# Altium schematic sheet rNET_POE_Sensor._Sheet2_RevA1.SchDoc
size D; Organization: Altium Limited; Address1: L3, 12a Rodborough Rd; Address2: Frenchs Forest; Address3: NSW; Address4: Australia 2086; SheetNumber: 2; PageSetup: Record=PageOptions|CenterHorizontal=True|CenterVertical=True|PrintScale=0.52|XCorrection=1.00|YCorrection=1.00|PrintKind=0|BorderSize=5000000|LeftOffset=0|BottomOffset=0|Orientation=2|PaperLength=4318|PaperWidth=2794|Scale=100|PaperSource=7|PrintQuality=-4|MediaType=1|DitherType=10|PrintScaleMode=1|PaperKind=Ledger (11 x 17 in)|PaperIndex=3
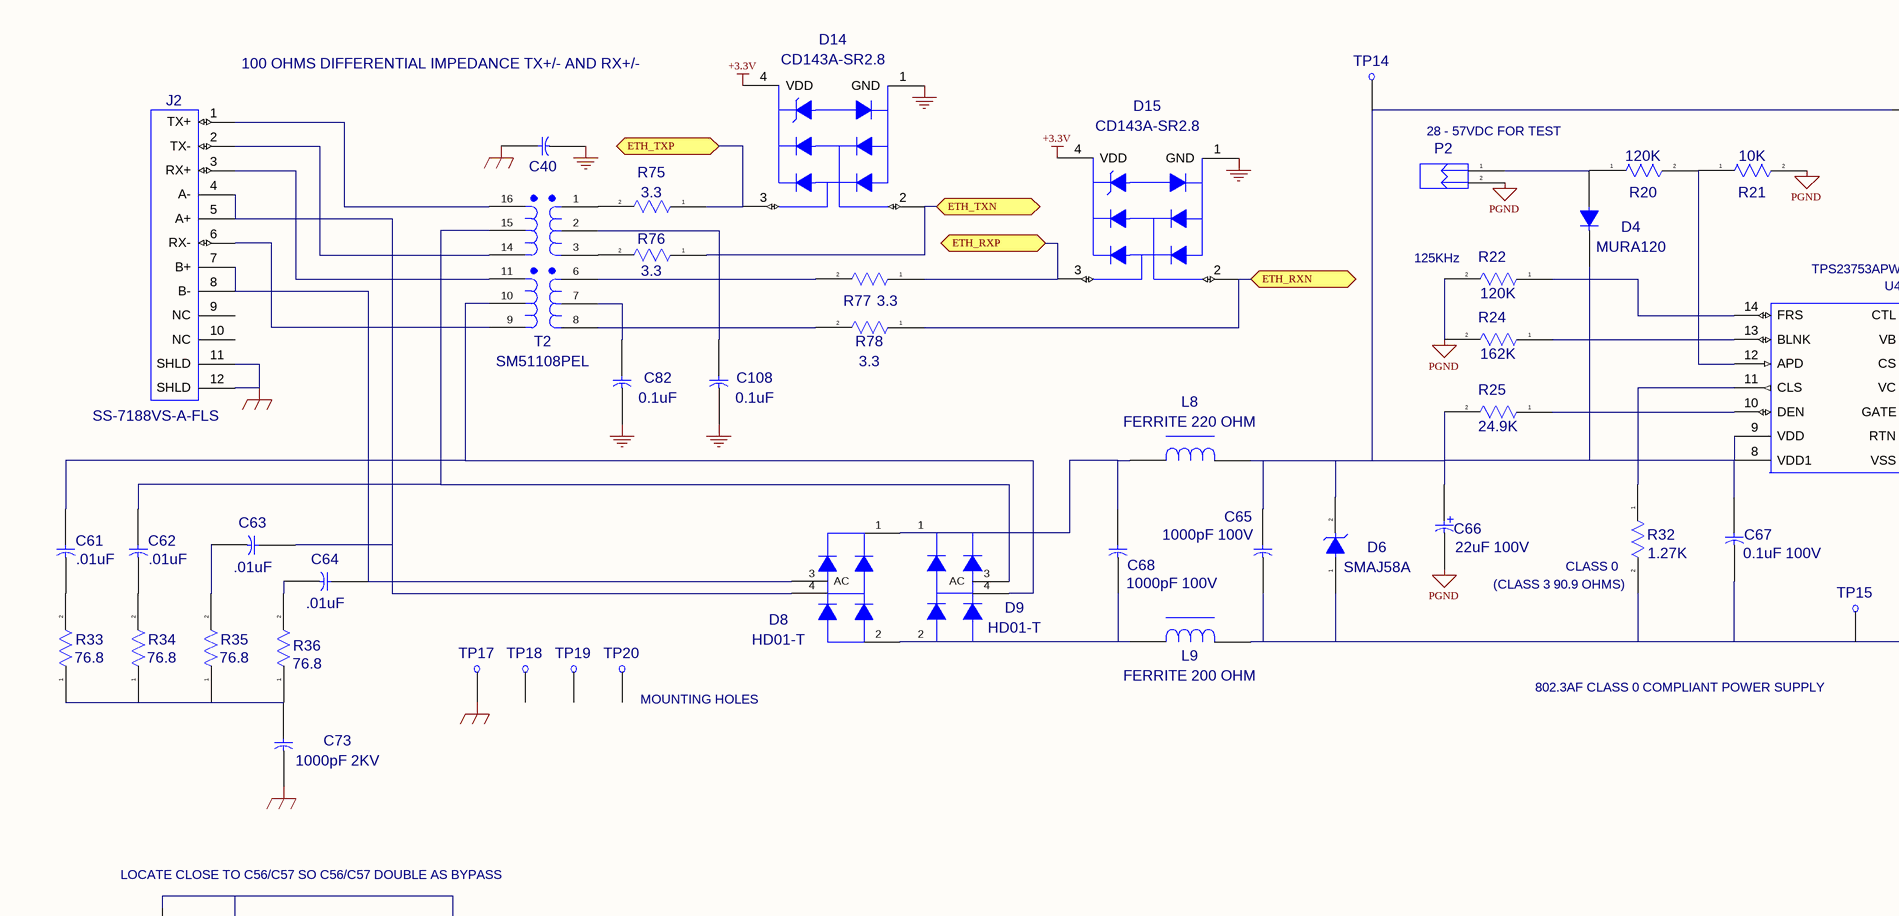
[diagram p0: rNET_POE_Sensor._Sheet2_RevA1.SchDoc, top left]
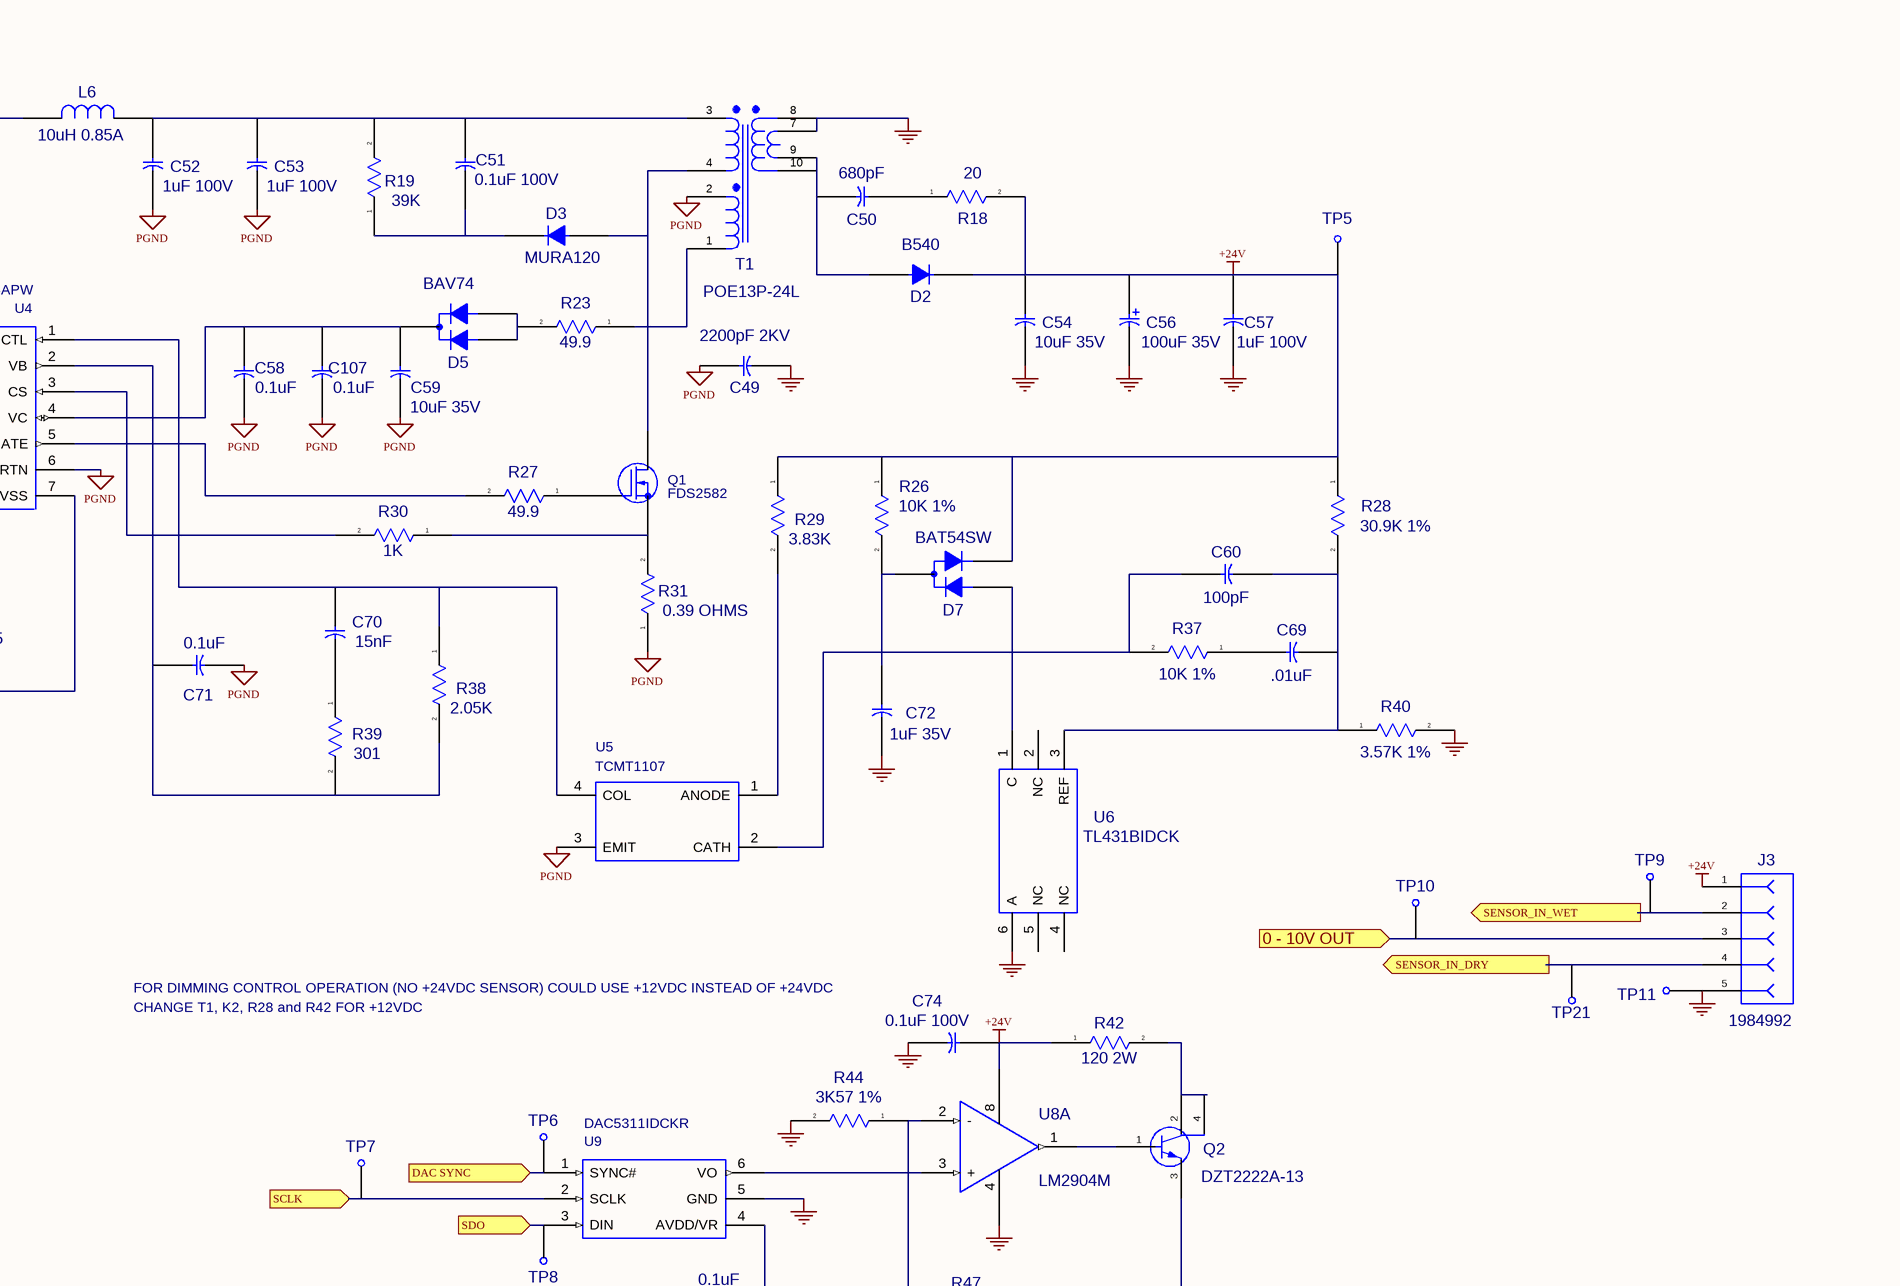
[diagram p1: rNET_POE_Sensor._Sheet2_RevA1.SchDoc, top right]
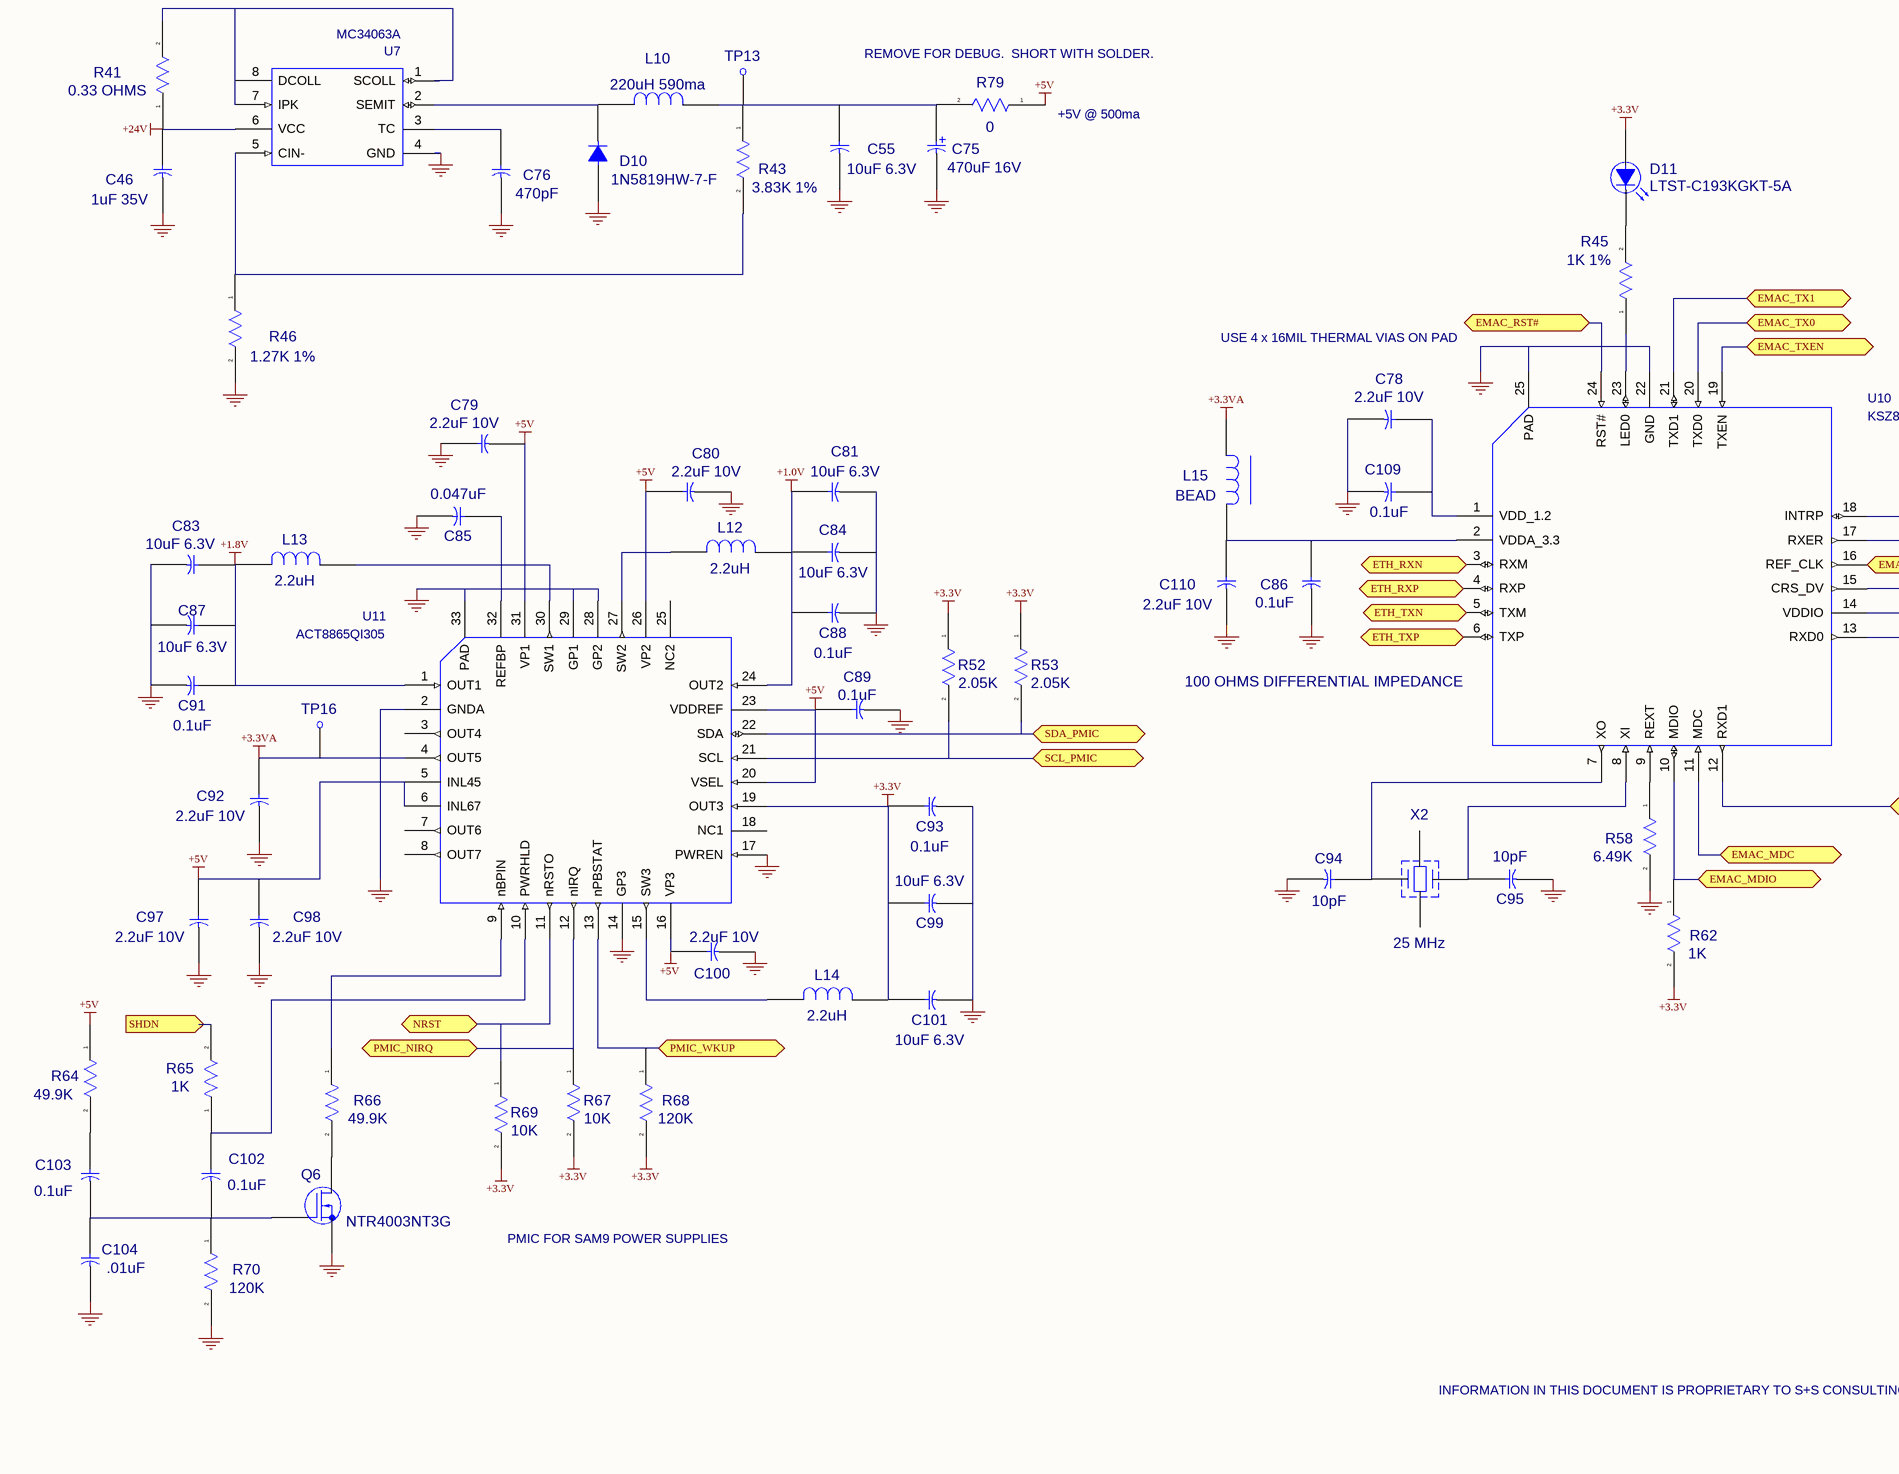
[diagram p2: rNET_POE_Sensor._Sheet2_RevA1.SchDoc, bottom left]
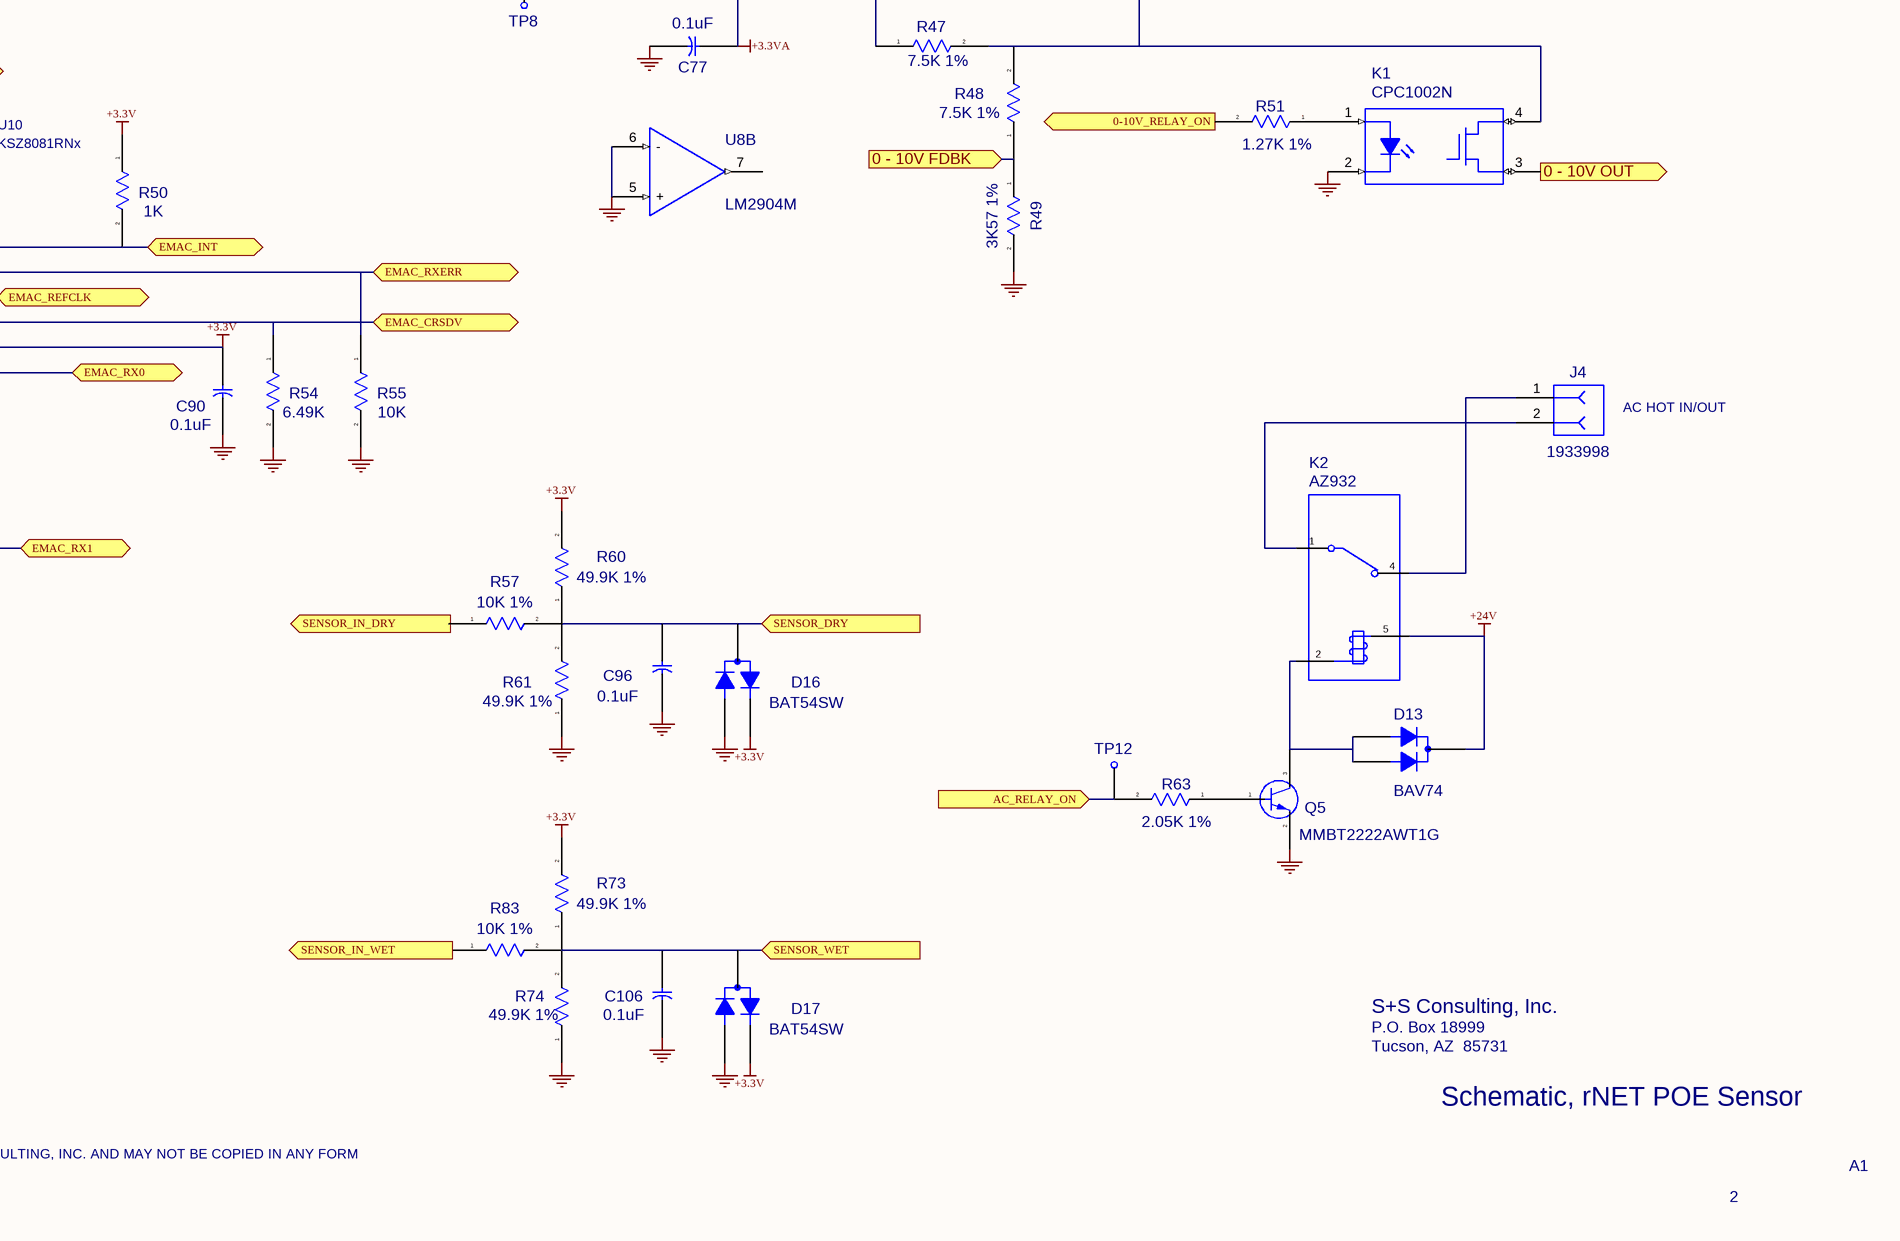
[diagram p3: rNET_POE_Sensor._Sheet2_RevA1.SchDoc, bottom right]

## Parts
C40  2200pF 2KV  [1210]  (value not drawn)
C46  1uF 35V  [0603LEAST]
C49  2200pF 2KV  [1210]
C50  680pF  [0603LEAST]
C51  0.1uF 100V  [0402NOM]
C52  1uF 100V  [1206]
C53  1uF 100V  [1206]
C54  10uF 35V  [1206]
C55  10uF 6.3V  [0402NOM]
C56  100uF 35V  [CAP_AL_SMD_8.3MM]
C57  1uF 100V  [1206]
C58  0.1uF  [0402NOM]
C59  10uF 35V  [1206]
C60  100pF  [0402NOM]
C61  .01uF  [0402NOM]
C62  .01uF  [0402NOM]
C63  .01uF  [0402NOM]
C64  .01uF  [0402NOM]
C65  1000pF 100V  [0603LEAST]
C66  22uF 100V  [CAP_AL_SMD_10.3MM]
C67  0.1uF 100V  [0402NOM]
C68  1000pF 100V  [0603LEAST]
C69  .01uF  [0402NOM]
C70  15nF  [0402NOM]
C71  0.1uF  [0402NOM]
C72  1uF 35V  [0603LEAST]
C73  1000pF 2KV  [1206]
C74  0.1uF 100V  [0402NOM]
C75  470uF 16V  [CAP_AL_SMD_8.3MM]
C76  470pF  [0402NOM]
C77  0.1uF  [0402NOM]
C78  2.2uF 10V  [0402NOM]
C79  2.2uF 10V  [0402NOM]
C80  2.2uF 10V  [0402NOM]
C81  10uF 6.3V  [0402NOM]
C82  0.1uF  [0402NOM]
C83  10uF 6.3V  [0402NOM]
C84  10uF 6.3V  [0402NOM]
C85  0.047uF  [0402NOM]
C86  0.1uF  [0402NOM]
C87  10uF 6.3V  [0402NOM]
C88  0.1uF  [0402NOM]
C89  0.1uF  [0402NOM]
C90  0.1uF  [0402NOM]
C91  0.1uF  [0402NOM]
C92  2.2uF 10V  [0402NOM]
C93  0.1uF  [0402NOM]
C94  10pF  [0402NOM]
C95  10pF  [0402NOM]
C96  0.1uF  [0402NOM]
C97  2.2uF 10V  [0402NOM]
C98  2.2uF 10V  [0402NOM]
C99  10uF 6.3V  [0402NOM]
C100  2.2uF 10V  [0402NOM]
C101  10uF 6.3V  [0402NOM]
C102  0.1uF  [0402NOM]
C103  0.1uF  [0402NOM]
C104  .01uF  [0402NOM]
C106  0.1uF  [0402NOM]
C107  0.1uF  [0402NOM]
C108  0.1uF  [0402NOM]
C109  0.1uF  [0402NOM]
C110  2.2uF 10V  [0402NOM]
D2  B540  [SMC1]
D3  MURA120  [SMAPWR]
D4  MURA120  [SMAPWR]
D5  BAV74  [SOT23-3]
D6  SMAJ58A  [SMAPWR]
D7  BAT54SW  [SC70]
D8  HD01-T  [SMD4-MINIDIP]
D9  HD01-T  [SMD4-MINIDIP]
D10  1N5819HW-7-F  [SMAEIA]
D11  LTST-C193KGKT-5A  [0603_POL]
D13  BAV74  [SOT23-3]
D14  CD143A-SR2.8  [SOT143]
D15  CD143A-SR2.8  [SOT143]
D16  BAT54SW  [SC70]
D17  BAT54SW  [SC70]
J2  SS-7188VS-A-FLS  [CONNVERTICALRJ45_SS-7188VS-A-FLS-SHIELDED]
J3  1984992  [TERMBLK1X5D3.5MMSPRING]
J4  1933998  [TERMBLK1X2X2D5MM_1933998]
K1  CPC1002N  [SOP4]
K2  AZ932  [AZ932FORMB]
L6  10uH 0.85A  [1008]
L8  FERRITE 220 OHM  [0603LEAST]
L9  FERRITE 200 OHM  [0603LEAST]
L10  220uH 590ma  [INDTAIYONRS6028]
L12  2.2uH  [INDTAIYONR2410T]
L13  2.2uH  [INDTAIYONR2410T]
L14  2.2uH  [INDTAIYONR2410T]
L15  BEAD  [0402NOM]
P2  HEADER1X2  [HEADER1X2]  (value not drawn)
Q1  FDS2582  [SOIC8]
Q2  DZT2222A-13  [SOT223]
Q5  MMBT2222AWT1G  [SOT323]
Q6  NTR4003NT3G  [SOT23-3]
R18  20  [1206]
R19  39K  [0603LEAST]
R20  120K  [0402NOM]
R21  10K  [0402NOM]
R22  120K  [0402NOM]
R23  49.9  [0402NOM]
R24  162K  [0402NOM]
R25  24.9K  [0402NOM]
R26  10K 1%  [0402NOM]
R27  49.9  [0402NOM]
R28  30.9K 1%  [0402NOM]
R29  3.83K  [0402NOM]
R30  1K  [0402NOM]
R31  0.39 OHMS  [1206]
R32  1.27K  [0402NOM]
R33  76.8  [0402NOM]
R34  76.8  [0402NOM]
R35  76.8  [0402NOM]
R36  76.8  [0402NOM]
R37  10K 1%  [0402NOM]
R38  2.05K  [0402NOM]
R39  301  [0402NOM]
R40  3.57K 1%  [0402NOM]
R41  0.33 OHMS  [0603LEAST]
R42  120 2W  [2512]
R43  3.83K 1%  [0402NOM]
R44  3K57 1%  [0402NOM]
R45  1K 1%  [0402NOM]
R46  1.27K 1%  [0402NOM]
R47  7.5K 1%  [0402NOM]
R48  7.5K 1%  [0402NOM]
R49  3K57 1%  [0402NOM]
R50  1K  [0402NOM]
R51  1.27K 1%  [0402NOM]
R52  2.05K  [0402NOM]
R53  2.05K  [0402NOM]
R54  6.49K  [0402NOM]
R55  10K  [0402NOM]
R57  10K 1%  [0402NOM]
R58  6.49K  [0402NOM]
R60  49.9K 1%  [0402NOM]
R61  49.9K 1%  [0402NOM]
R62  1K  [0402NOM]
R63  2.05K 1%  [0402NOM]
R64  49.9K  [0402NOM]
R65  1K  [0402NOM]
R66  49.9K  [0402NOM]
R67  10K  [0402NOM]
R68  120K  [0402NOM]
R69  10K  [0402NOM]
R70  120K  [0402NOM]
R73  49.9K 1%  [0402NOM]
R74  49.9K 1%  [0402NOM]
R75  3.3  [0402NOM]
R76  3.3  [0402NOM]
R77  3.3  [0402NOM]
R78  3.3  [0402NOM]
R79  0  [0402NOM]
R83  10K 1%  [0402NOM]
T1  POE13P-24L  [XFMR_POE13P]
T2  SM51108PEL  [XFMR WURTH 749013011]
TP5  +24V  [TESTPOINTTOPD25]  (value not drawn)
TP6  DAC SYNC  [TESTPOINTTOPD25]  (value not drawn)
TP7  SCLK  [TESTPOINTTOPD25]  (value not drawn)
TP8  SDO  [TESTPOINTTOPD25]  (value not drawn)
TP9  SENSOR  [TESTPOINTTOPD25]  (value not drawn)
TP10  0-10V  [TESTPOINTTOPD25]  (value not drawn)
TP11  GND  [TESTPOINTTOPD25]  (value not drawn)
TP12  AC RELAY  [TESTPOINTTOPD25]  (value not drawn)
TP13  +5V  [TESTPOINTTOPD25]  (value not drawn)
TP14  VIN  [TESTPOINTTOPD25]  (value not drawn)
TP15  PGND  [TESTPOINTTOPD25]  (value not drawn)
TP16  +3.3VA  [TESTPOINTTOPD25]  (value not drawn)
TP17  MOUNTING  [TESTPOINT250D130]  (value not drawn)
TP18  MOUNTING  [TESTPOINT250D130]  (value not drawn)
TP19  MOUNTING  [TESTPOINT250D130]  (value not drawn)
TP20  MOUNTING  [TESTPOINT250D130]  (value not drawn)
TP21  SENSOR_L  [TESTPOINTTOPD25]  (value not drawn)
U4  TPS23753APW  [TSSOP14]
U5  TCMT1107  [SSOP4]
U6  TL431BIDCK  [SC70-6]
U7  MC34063A  [SOIC8N]
U8  LM2904M  [SOIC8N]  (parts A,B of 2)
U9  DAC5311IDCKR  [SC70-6]
U10  KSZ8081RNx  [QFN24]
U11  ACT8865QI305  [TQFN44-32]
X2  25 MHz  [XTALXRCGB]

## Ports
0 - 10V FDBK (out), 0 - 10V OUT (in), 0 - 10V OUT (out), 0-10V_RELAY_ON (in), AC_RELAY_ON (in), DAC SYNC (in), EMAC_CRSDV (bidir), EMAC_INT (bidir), EMAC_MDC (bidir), EMAC_MDIO (bidir), EMAC_REFCLK (bidir), EMAC_RST# (bidir), EMAC_RX0 (bidir), EMAC_RX1 (bidir), EMAC_RXERR (bidir), EMAC_TX0 (bidir), EMAC_TX1 (bidir), EMAC_TXEN (bidir), ETH_RXN (bidir), ETH_RXP (bidir), ETH_TXN (bidir), ETH_TXP (bidir), NRST (bidir), PMIC_NIRQ (bidir), PMIC_WKUP (bidir), SCL_PMIC (bidir), SCLK (in), SDA_PMIC (bidir), SDO (in), SENSOR_DRY (out), SENSOR_IN_DRY (in), SENSOR_IN_DRY (out), SENSOR_IN_WET (in), SENSOR_IN_WET (out), SENSOR_WET (out), SHDN (in)

## Nets
+1.0V: C81.2 C84.2 C88.2 L12.1 U11.24(OUT2)
+1.8V: C83.2 C87.2 C91.2 L13.2 U11.1(OUT1)
+3.3V: C90.2 C93.2 C99.2 C101.2 D11.2(A) D14.4(VDD) D15.4(VDD) D16.2(C) D17.2(C) L14.1 R50.1 R52.1 R53.1 R60.2 R62.2 R67.2 R68.2 R69.2 R73.2 U10.14(VDDIO) U11.19(OUT3)
+3.3VA: C77.2 C92.2 L15.2 TP16.1 U9.4(AVDD/VR) U11.4(OUT5)
+5V: C79.1 C80.2 C89.2 C97.2 C98.2 C100.2 R64.1 R79.1 U11.5(INL45) U11.6(INL67) U11.16(VP3) U11.20(VSEL) U11.23(VDDREF) U11.26(VP2) U11.31(VP1)
+24V: C46.2 C54.2 C56.2 C57.2 C74.2 D2.2(C) D7.2(C) D13.3(C) J3.1 K2.5 R18.2 R26.1 R28.1 R29.1 R41.1 R42.1 TP5.1 U7.6(VCC) U8.8(V+)
CHASSIS: C40.2 C73.1 J2.11(SHLD) J2.12(SHLD) TP17.1
GND: C40.1 C46.1 C49.1 C54.1 C55.1 C56.1 C57.1 C72.1 C74.1 C75.1 C76.1 C77.1 C78.1 C79.2 C80.1 C81.1 C82.1 C83.1 C84.1 C85.1 C86.1 C87.1 C88.1 C89.1 C90.1 C91.1 C92.1 C93.1 C94.1 C95.1 C96.1 C97.1 C98.1 C99.1 C100.1 C101.1 C104.1 C106.1 C108.1 C109.1 C110.1 D10.1(A) D14.1(GND) D15.1(GND) D16.1(A) D17.1(A) J3.5 K1.2(CATH) Q5.2(Emitter) Q6.2(S) R40.2 R44.2 R46.2 R49.2 R54.2 R55.2 R58.2 R61.1 R70.2 R74.1 T1.7(SEC+) T1.8(SEC+) TP11.1 U6.6(A) U7.4(GND) U8.4(GND) U8.5(+) U8.6(-) U9.5(GND) U10.22(GND) U10.25(PAD) U11.2(GNDA) U11.14(GP3) U11.17(PWREN) U11.28(GP2) U11.29(GP1) U11.33(PAD)
PGND: C49.2 C52.1 C53.1 C58.1 C59.1 C66.1 C71.1 C107.1 P2.2 R21.2 R22.2 R24.2 R31.1 T1.2(BIAS+) U4.6(RTN) U5.3(EMIT)
0 - 10V FDBK: R48.1 R49.1 ; port 0 - 10V FDBK
0 - 10V OUT: J3.3 K1.3(DRAIN) TP10.1 ; port 0 - 10V OUT
0-10V_RELAY_ON: R51.2 ; port 0-10V_RELAY_ON
AC_RELAY_ON: R63.2 TP12.1 ; port AC_RELAY_ON
DAC SYNC: TP6.1 U9.1(SYNC#) ; port DAC SYNC
EMAC_CRSDV: R54.1 U10.15(CRS_DV) ; port EMAC_CRSDV
EMAC_INT: R50.2 U10.18(INTRP) ; port EMAC_INT
EMAC_MDC: U10.11(MDC) ; port EMAC_MDC
EMAC_MDIO: R62.1 U10.10(MDIO) ; port EMAC_MDIO
EMAC_REFCLK: U10.16(REF_CLK) ; port EMAC_REFCLK
EMAC_RST#: U10.24(RST#) ; port EMAC_RST#
EMAC_RX0: U10.13(RXD0) ; port EMAC_RX0
EMAC_RX1: U10.12(RXD1) ; port EMAC_RX1
EMAC_RXERR: R55.1 U10.17(RXER) ; port EMAC_RXERR
EMAC_TX0: U10.20(TXD0) ; port EMAC_TX0
EMAC_TX1: U10.21(TXD1) ; port EMAC_TX1
EMAC_TXEN: U10.19(TXEN) ; port EMAC_TXEN
ETH_RXN: D15.2(I/O) R78.1 ; port ETH_RXN
ETH_RXP: D15.3(I/O) R77.1 ; port ETH_RXP
ETH_TXN: D14.2(I/O) R76.1 ; port ETH_TXN
ETH_TXP: D14.3(I/O) R75.1 ; port ETH_TXP
NRST: R69.1 U11.11(nRSTO) ; port NRST
PMIC_NIRQ: R67.1 U11.12(nIRQ) ; port PMIC_NIRQ
PMIC_WKUP: R68.1 U11.13(nPBSTAT) ; port PMIC_WKUP
SCL_PMIC: R52.2 U11.21(SCL) ; port SCL_PMIC
SCLK: TP7.1 U9.2(SCLK) ; port SCLK
SDA_PMIC: R53.2 U11.22(SDA) ; port SDA_PMIC
SDO: TP8.1 U9.3(DIN) ; port SDO
SENSOR_DRY: C96.2 D16.3(AC) R57.2 R60.1 R61.2 ; port SENSOR_DRY
SENSOR_IN_DRY: J3.4 TP21.1 ; port SENSOR_IN_DRY
SENSOR_IN_WET: J3.2 TP9.1 ; port SENSOR_IN_WET
SENSOR_WET: C106.2 D17.3(AC) R73.1 R74.2 R83.2 ; port SENSOR_WET
SHDN: R65.2 ; port SHDN
NetC50_1: C50.1 D2.1(A) T1.9(SEC-) T1.10(SEC-)
NetC50_2: C50.2 R18.1
NetC51_1: C51.1 D3.2(C) R19.1
NetC51_2: C51.2 C52.2 C53.2 L6.1 R19.2 T1.3(PRI+)
NetC55_2: C55.2 C75.2 L10.1 R43.1 R79.2 TP13.1
NetC58_2: C58.2 C59.2 C107.2 D5.3(C) U4.4(VC)
NetC60_1: C60.1 C69.1 R28.2 R40.1 U6.3(REF)
NetC60_2: C60.2 D7.1(A) R37.2 U5.2(CATH) U6.1(C)
NetC61_1: C61.1 R33.2
NetC61_2: C61.2 D9.4(AC) T2.10(TXCT)
NetC62_1: C62.1 R34.2
NetC62_2: C62.2 D9.3(AC) T2.15(RXCT)
NetC63_1: C63.1 R35.2
NetC63_2: C63.2 D8.4(AC) J2.4(A-) J2.5(A+)
NetC64_1: C64.1 R36.2
NetC64_2: C64.2 D8.3(AC) J2.7(B+) J2.8(B-)
NetC65_1: C65.1 C67.1 D6.1(A) L9.1 R32.2 TP15.1 U4.7(VSS)
NetC65_2: C65.2 C66.2 C67.2 D4.2(C) D6.2(C) L6.2 L8.1 R25.2 TP14.1 U4.8(VDD1) U4.9(VDD)
NetC68_1: C68.1 D8.2(-) D9.2(-) L9.2
NetC68_2: C68.2 D8.1(+) D9.1(+) L8.2
NetC69_2: C69.2 R37.1
NetC70_1: C70.1 R39.1
NetC70_2: C70.2 R38.1 U4.1(CTL) U5.4(COL)
NetC71_2: C71.2 R38.2 R39.2 U4.2(VB)
NetC72_2: C72.2 D7.3(AC) R26.2
NetC73_2: C73.2 R33.1 R34.1 R35.1 R36.1
NetC76_2: C76.2 U7.3(TC)
NetC78_2: C78.2 C109.2 U10.1(VDD_1.2)
NetC82_2: C82.2 T2.7(TCT)
NetC85_2: C85.2 U11.32(REFBP)
NetC86_2: C86.2 C110.2 L15.1 U10.2(VDDA_3.3)
NetC94_2: C94.2 U10.7(XO) X2.1
NetC95_2: C95.2 U10.8(XI) X2.3
NetC102_1: C102.1 C103.1 C104.2 Q6.1(G) R70.1
NetC102_2: C102.2 R65.1 U11.10(PWRHLD)
NetC103_2: C103.2 R64.2
NetC108_2: C108.2 T2.2(RCT)
NetD3_1: D3.1(A) Q1.5(D) Q1.6(D) Q1.7(D) Q1.8(D) T1.4(PRI-)
NetD4_1: D4.1(A) P2.1 R20.1
NetD5_1: D5.1(A) D5.2(A) R23.2
NetD10_2: D10.2(C) L10.2 U7.2(SEMIT)
NetD11_1: D11.1(C) R45.2
NetD13_1: D13.1(A) D13.2(A) K2.2 Q5.3(Collector)
NetJ2_1: J2.1(TX+) T2.16(RX+)
NetJ2_2: J2.2(TX-) T2.14(RX-)
NetJ2_3: J2.3(RX+) T2.11(TX+)
NetJ2_6: J2.6(RX-) T2.9(TX-)
NetJ4_1: J4.1 J4.3 K2.4
NetJ4_2: J4.2 J4.4 K2.1
NetK1_1: K1.1(ANODE) R51.1
NetK1_4: K1.4(DRAIN) Q2.3(E) R47.2 R48.2
NetL12_2: L12.2 U11.27(SW2)
NetL13_1: L13.1 U11.30(SW1)
NetL14_2: L14.2 U11.15(SW3)
NetQ1_1: Q1.1(S) Q1.2(S) Q1.3(S) R30.1 R31.2
NetQ1_4: Q1.4(G) R27.1
NetQ2_1: Q2.1(B) U8.1(OUT)
NetQ2_2: Q2.2(C) Q2.4(C) R42.2
NetQ5_1: Q5.1(Base) R63.1
NetQ6_3: Q6.3(D) R66.2
NetR20_2: R20.2 R21.1 U4.12(APD)
NetR22_1: R22.1 U4.14(FRS)
NetR23_1: R23.1 T1.1(BIAS-)
NetR24_1: R24.1 U4.13(BLNK)
NetR25_1: R25.1 U4.10(DEN)
NetR27_2: R27.2 U4.5(GATE)
NetR29_2: R29.2 U5.1(ANODE)
NetR30_2: R30.2 U4.3(CS)
NetR32_1: R32.1 U4.11(CLS)
NetR41_2: R41.2 U7.1(SCOLL) U7.7(IPK) U7.8(DCOLL)
NetR43_2: R43.2 R46.1 U7.5(CIN-)
NetR44_1: R44.1 R47.1 U8.2(-)
NetR45_1: R45.1 U10.23(LED0)
NetR58_1: R58.1 U10.9(REXT)
NetR66_1: R66.1 U11.9(nBPIN)
NetR75_2: R75.2 T2.1(RD+)
NetR76_2: R76.2 T2.3(RD-)
NetR77_2: R77.2 T2.6(TD+)
NetR78_2: R78.2 T2.8(TD-)
NetU8_3: U8.3(+) U9.6(VO)

Not connected (* = marked no-connect by the designer): J2 9(NC) 10(NC) 13 14; J3 9 10 11 12; J4 9 10 11 12; R57 1; R83 1; TP18 1; TP19 1; TP20 1; U6 2(NC) 4(NC) 5(NC); U8 7(OUT); U10 3(RXM) 4(RXP) 5(TXM) 6(TXP); U11 3(OUT4) 7(OUT6) 8(OUT7) 18(NC1) 25(NC2); X2 2 4

## Notes on the sheet
- 100 OHMS DIFFERENTIAL IMPEDANCE TX+/- AND RX+/-
- (near P2) 28 - 57VDC FOR TEST
- (near R22) 125KHz
- (near R32) CLASS 0
- (near R32) (CLASS 3 90.9 OHMS)
- (near TP20) MOUNTING HOLES
- 802.3AF CLASS 0 COMPLIANT POWER SUPPLY
- LOCATE CLOSE TO C56/C57 SO C56/C57 DOUBLE AS BYPASS
- (near R79) REMOVE FOR DEBUG.  SHORT WITH SOLDER.
- FOR DIMMING CONTROL OPERATION (NO +24VDC SENSOR) COULD USE +12VDC INSTEAD OF +24VDC
- CHANGE T1, K2, R28 and R42 FOR +12VDC
- +5V @ 500ma
- USE 4 x 16MIL THERMAL VIAS ON PAD
- 100 OHMS DIFFERENTIAL IMPEDANCE
- AC HOT IN/OUT
- PMIC FOR SAM9 POWER SUPPLIES
- S+S Consulting, Inc.
- P.O. Box 18999
- Tucson, AZ  85731
- Schematic, rNET POE Sensor
- INFORMATION IN THIS DOCUMENT IS PROPRIETARY TO S+S CONSULTING, INC. AND MAY NOT BE COPIED IN ANY FORM
- 2
- A1

## Library data of the parts
C40 C49 = CCAP1210: Value: {Value}; Part Number: CCAP1210
C46 C50 C65 C68 C72 = CCAP0603L: Value: {Value}; Part Number: CCAP0603L
C51 C55 C58 C60-C64 C67 C69-C71 C74 C76-C104 C106-C110 = CCAP0402: Value: {Value}; Part Number: CCAP0402
C52-C54 C57 C59 C73 = CCAP1206: Value: {Value}; Part Number: CCAP1206
C56 C75 = CAP_AL_SMD_8.3MM: Value: {Value}; Part Number: CAP_AL_SMD_8.3MM
C66 = CAP_AL_SMD_10.3MM: Value: {Value}; Part Number: CAP_AL_SMD_10.3MM
D2 = DIODESMC1: Value: {Value}; Part Number: DIODESMC1
D3 D4 = DIODESMAPWR: Value: {Value}; Part Number: DIODESMAPWR
D5 D13 = BBAV74ZX: Part Number: BBAV74ZX; Value: *
D6 = ZZENERSMAPWR: Value: {Value}; Part Number: ZZENERSMAPWR
D7 D16 D17 = BBAT54SC70: Part Number: BBAT54SC70; Value: *
D8 D9 = HD01-T: Value: {Value}; Part Number: HD01-T
D10 = DIODESMAEIA: Value: {Value}; Part Number: DIODESMAEIA
D11 = LED_0603_C1A2: Value: {Value}; Part Number: LED_0603_C1A2
D14 D15 = CD143A-SR2.8: Value: {Value}; Part Number: CD143A-SR2.8
J2 = CONNVERTICALRJ45_SS-7188VS-A-FLS-SHIELDED: Value: {Value}; Part Number: CONNVERTICALRJ45_SS-7188VS-A-FLS-SHIELDED
J3 = TERMBLK1X5D3.5MMSPRING: Part Number: TERMBLK1X5D3.5MMSPRING; Value: *
J4 = TERMBLK1X2X2D5MM_1933998: Part Number: TERMBLK1X2X2D5MM_1933998; Value: *
K2 = AZ932FORMB: Part Number: AZ932FORMB; Value: *
L6 = IND1008: Value: {Value}; Part Number: IND1008
L8 L9 = FERRITE0603L: Value: {Value}; Part Number: FERRITE0603L
L10 = INDTAIYONRS6028: Value: {Value}; Part Number: INDTAIYONRS6028
L12-L14 = INDTAIYONR2410T: Value: {Value}; Part Number: INDTAIYONR2410T
L15 = FERRITE0402: Value: {Value}; Part Number: FERRITE0402
Q1 = SI4386DY: Value: {Value}; Part Number: SI4386DY
Q2 = FZT2222A: Value: {Value}; Part Number: FZT2222A
Q5 = NPNSOT323: Value: {Value}; Part Number: NPNSOT323
Q6 = FETNSOT23: Value: {Value}; Part Number: FETNSOT23
R18 R31 = RRES1206: Value: {Value}; Part Number: RRES1206
R19 R41 = RRES0603L: Value: {Value}; Part Number: RRES0603L
R20-R30 R32-R40 R43-R55 R57 R58 R60-R70 R73-R79 R83 = RRES0402: Value: {Value}; Part Number: RRES0402
R42 = RRES2512: Value: {Value}; Part Number: RRES2512
T1 = XFMR_POE13P: Value: {Value}; Part Number: XFMR_POE13P
T2 = XFMR WURTH 749013011: Value: {Value}; Part Number: XFMR WURTH 749013011
TP5-TP16 TP21 = TESTPOINTTOPD25: Part Number: TESTPOINTTOPD25; Value: *
TP17-TP20 = TESTPOINT250D130: Part Number: TESTPOINT250D130; Value: *
U7 = MC3x063A: Part Number: MC3x063A; Value: *
U8 = LM2904M_N: Low Power Dual OPERATIONAL AMPLIFIER; Part Number: LM2904M_N; Value: *
U9 = DACx311IDCKR: Part Number: DACx311IDCKR; Value: *
U10 = KXA8081RNx: Part Number: KXA8081RNx; Value: *
U11 = ACT8865QIx05: Part Number: ACT8865QIx05; Value: *
X2 = XTALXRCGB: Value: {Value}; Part Number: XTALXRCGB
K1 = CPC1002N: Part Number: CPC1002N; Value: *
P2 = HEADER1X2: Part Number: HEADER1X2; Value: *
U4 = TPS23753APW: Part Number: TPS23753APW; Value: *
U5 = TCMT1107: Part Number: TCMT1107; Value: *
U6 = TL431BIDCK: Part Number: TL431BIDCK; Value: *